# Altium schematic sheet TC2030-NL_TagConnect_6-pin.SchDoc: TC2030-NL Tag-Connect
size A4
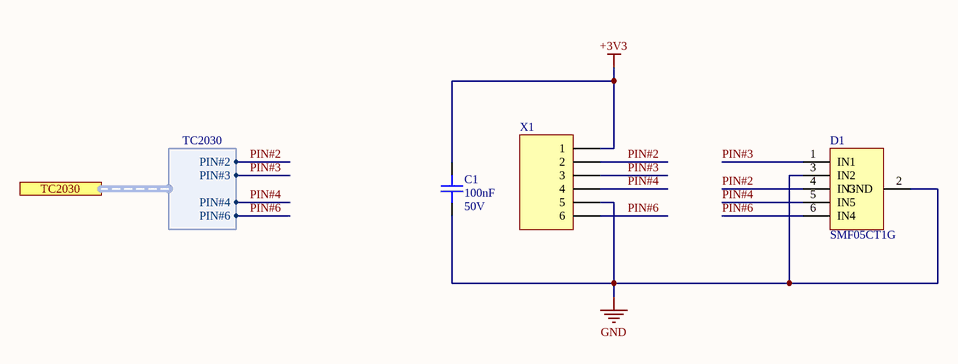
[diagram p0: TC2030-NL_TagConnect_6-pin.SchDoc]

## Parts
C1  Capacitance: 100nF  Voltage: 50V  [C0402]  (hidden comment: CAP CER 0.1UF 50V X7R 0402)
D1  SMF05CT1G  [SOT363_SOP65P210X265-6N]
X1  (no value)  [TC2030-IDC-NL]  (no BOM)

## Ports
TC2030 (harness TC2030)

## Harnesses
TC2030: PIN#2, PIN#3, PIN#4, PIN#6

## Nets
+3V3: C1.2 X1.1
GND: C1.1 D1.2(GND) D1.3(IN2) X1.5
PIN#2: D1.4(IN3) X1.2 ; port TC2030.PIN#2
PIN#3: D1.1(IN1) X1.3 ; port TC2030.PIN#3
PIN#4: D1.5(IN5) X1.4 ; port TC2030.PIN#4
PIN#6: D1.6(IN4) X1.6 ; port TC2030.PIN#6

## Notes on the sheet
- Title
- Size:
- Date:
- A4
- Number:
- Time:
- Revision:
- Sheet
- of
- File:

## Library data of the parts
C1 = CAP CER 0.1UF 50V X7R 0402: 0.1µF ±10% 50V Ceramic Capacitor X7R 0402 (1005 Metric); Manufacturer: TDK; Manufacturer Part Number: CGA2B3X7R1H104K050BB; Supplier 1: Digi-Key; Stock 1: 2925303; Pricing 1: 1=0.17, 10=0.118, 50=0.0668, 100=0.0553, 500=0.0388, 1000=0.0321, 2500=0.0299, 5000=0.0273 (USD); Mount: Surface Mount; Case/Package: 0402; Weight: 2.3E-05oz; Case Code (Metric): 1005; Case Code (Imperial): 0402; Min Operating Temperature: -55°C; Max Operating Temperature: 125°C; Voltage Rating: 50V; Tolerance: 10%; Packaging: Tape and Reel; Package Quantity: 1; Voltage Rating (DC): 50V; Dielectric: X7R; Termination: SMD/SMT; Composition: Ceramic; Length: 1mm; Height: 0.5mm; Width: 0.02inch; Thickness: 0.022inch; Depth: 0.5mm; Ratings: AEC-Q200; REACH SVHC: No SVHC; Lead Free: Lead Free; ComponentLink1URL: http://product.tdk.com/capacitor/mlcc/en/documents/mlccspec_automotive_general_midvoltage_en.pdf?src-supplier=Future+Electronics; ComponentLink1Description: http://product.tdk.com/capacitor/mlcc/en/documents/mlccspec_automotive_general_midvoltage_en.pdf?src-supplier=Future+Electronics; ComponentLink2URL: http://www.farnell.com/datasheets/1807242.pdf?src-supplier=Element14; ComponentLink2Description: http://www.farnell.com/datasheets/1807242.pdf?src-supplier=Element14; ComponentLink3URL: http://www.mouser.com/ds/2/400/lcc_automotive_general_en-843974.pdf?src-supplier=Mouser; ComponentLink3Description: http://www.mouser.com/ds/2/400/lcc_automotive_general_en-843974.pdf?src-supplier=Mouser; ComponentLink4URL: http://www.farnell.com/datasheets/1936565.pdf?src-supplier=Element14; ComponentLink4Description: http://www.farnell.com/datasheets/1936565.pdf?src-supplier=Element14; ComponentLink5URL: http://www.farnell.com/datasheets/1735392.pdf?src-supplier=Element14; ComponentLink5Description: http://www.farnell.com/datasheets/1735392.pdf?src-supplier=Element14; Supplier Part Number 1: 445-6899-1-ND
D1 = TVS DIODE 5V 12.5V 5CH SC88: 12.5V Clamp 8A (8/20µs) Ipp Tvs Diode Surface Mount SC-88/SC70-6/SOT-363; Manufacturer: ON Semiconductor; Capacitance: 130pF; Direction: Unidirectional; Reverse Breakdown Voltage: 6.2V; Number of Elements: 5; Reverse Standoff Voltage: 5V; Peak Pulse Power: 100W; Power Line Protection: No; Leakage Current: 5uA; Test Current: 1mA; ESD Protection: Yes; Max Breakdown Voltage: 7.2V; Element Configuration: Common Anode; Supplier 1: Digi-Key; Manufacturer Part Number: SMF05CT1G; Stock 1: 33811; Pricing 1: 1=0.41, 10=0.307, 25=0.2768, 100=0.1459, 250=0.1444, 500=0.1293, 1000=0.1006 (USD); Case/Package: SC; Number of Pins: 6; Min Operating Temperature: -40°C; Max Operating Temperature: 125°C; Packaging: Tape and Reel; Number of Channels: 5; Min Breakdown Voltage: 6.2V; Clamping Voltage: 12.5V; Peak Pulse Current: 8A; Polarity: Unidirectional; Working Voltage: 5V; Max Reverse Leakage Current: 5uA; Max Power Dissipation: 100W; Breakdown Voltage: 6.2V; Voltage Rating (DC): 5V; Length: 2mm; Height: 1mm; Width: 1.25mm; Depth: 1.25mm; Radiation Hardening: No; REACH SVHC: No SVHC; Lead Free: Lead Free; ComponentLink1URL: http://www.farnell.com/datasheets/1708354.pdf?src-supplier=Element14; ComponentLink1Description: http://www.farnell.com/datasheets/1708354.pdf?src-supplier=Element14; ComponentLink2URL: http://www.onsemi.com/pub/Collateral/SMF05C-D.PDF?src-supplier=Digi-Key; ComponentLink2Description: http://www.onsemi.com/pub/Collateral/SMF05C-D.PDF?src-supplier=Digi-Key; ComponentLink3URL: http://www.mouser.com/ds/2/308/SMF05C-D-100912.pdf?src-supplier=Mouser; ComponentLink3Description: http://www.mouser.com/ds/2/308/SMF05C-D-100912.pdf?src-supplier=Mouser; ComponentLink4URL: http://www.onsemi.com/pub/Collateral/SMF05C-D.PDF?src-supplier=Avnet; ComponentLink4Description: http://www.onsemi.com/pub/Collateral/SMF05C-D.PDF?src-supplier=Avnet; ComponentLink5URL: https://www.verical.com/server-webapp/html/getDatasheet?partID=98371&src-supplier=Verical; ComponentLink5Description: https://www.verical.com/server-webapp/html/getDatasheet?partID=98371&src-supplier=Verical; Supplier Part Number 1: SMF05CT1GOSCT-ND; Contact Plating: Tin,Matte; Package Quantity: 1; Max Surge Current: 8A; Number of Unidirectional Channels: 5; Termination: SMD/SMT; Power Dissipation: 100W; Max Output Current: 8A; Composition: Zener; Mount: Surface Mount
X1 = TC2030-IDC-NL: Tag-Connect TC2030-MCP-NL (3x2 pins No Legs); Manufacturer: Tag-Connect LLC; Manufacturer Part Number: TC2030-IDC-NL